# EAGLE schematic shematic (EAGLE 8.3.2)
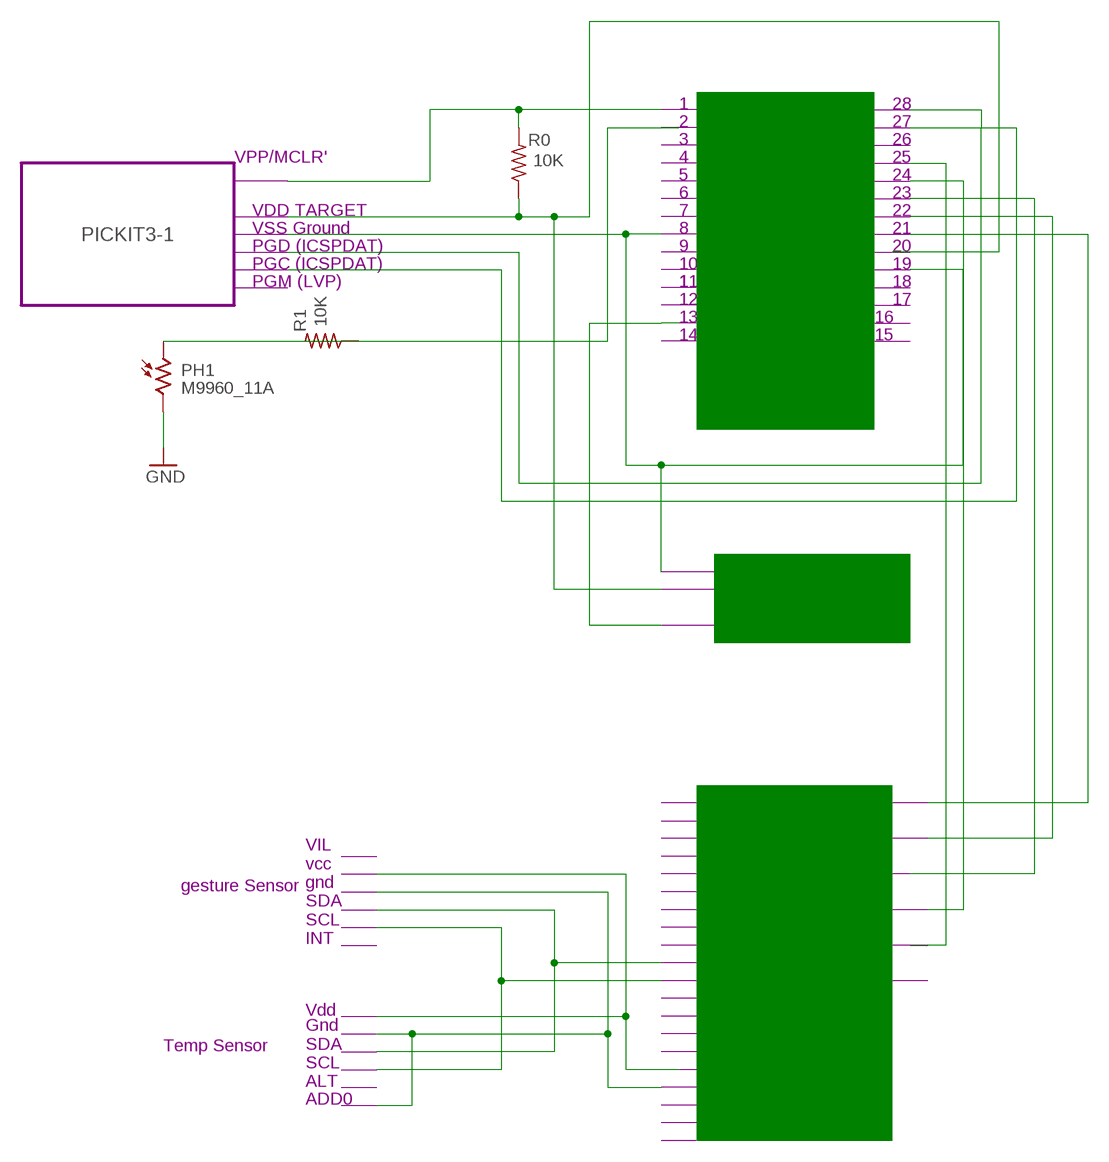
[diagram p0: schematic, sheet 1]

## Parts
PH1  M9960_11A  [M9960]
R0  10K  R-US_M0805  [M0805]
R1  10K  R-US_M0805  [M0805]

## Module instances
PICKIT3-1 = PICKIT3

## Nets
GND: PH1.2
N$5: R0.2
N$6: R0.1
N$9: PH1.1
Unconnected: R1.1 R1.2

## Notes on the sheet
- 1 | 28
- 2 | 27
- 3 | 26
- VPP/MCLR' | 4
- Vpp/MCLR/RE3
  RA0
  RA1
  RA2
- RB7
  RB6
  RB5
  RB4
- 25
- 5 | 24
- 6
- RA3
  RA4
- 23
- VDD TARGET | 7 | RA5
- RB3
  RB2
  RB1
- 22
- VSS Ground | 8 | VSS | PIC16F18857 | PIC16F18857 | PIC16F18857 | PIC16F18857 | 21
- PGD (ICSPDAT) | 9 | PIC16F18857 | PIC16F18857 | 20
- PGC (ICSPDAT) | 10 | 19
- PGM (LVP) | 1 | 11
- RA7
  RA6
  Rc0
- 18
- 12 | RC1 | 17
- 13 | 16
- 14
- RC2
  RC3
- RB0
  vdd
  vss
  RC7
  RC6
  RC5
  RC4
- 15
- Gnd
- VDD
- Servo Motor
- PWM
- IO8 | IO3 | IO3
- IO4
- IO5
- gesture Sensor
- IO7
  IO6
  IO5
  IO4
  IO3
- IO6
- IO8
- VIL
  vcc
  gnd
  SDA
  SCL
  INT
- A4 | A4 | A4
- A5
- Vdd | Intel galileo gen2
- Temp Sensor
- Gnd
  SDA
  SCL
  ALT
- 3.3
  Gnd
- ADD0

## Library data of the parts
PH1 = photo-elements:M9960_11: Photo Sensor Beacon Light, Photometer Applications Source: http://optoelectronics.perkinelmer.com/content/Datasheets/DTS_M9960.pdf
R0 R1 = resistor:R-US_: RESISTOR, American symbol

## Module PICKIT3
Ports: 

### Library data of the parts